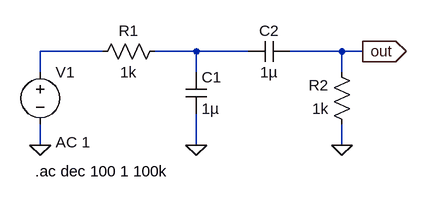
[diagram p0: schematic Frequency_Response_BandPass.asc]
Frequency_Response_BandPass.asc, the LTspice schematic file:
Version 4
SHEET 1 880 680
WIRE 128 112 32 112
WIRE 272 112 208 112
WIRE 352 112 272 112
WIRE 496 112 416 112
WIRE 528 112 496 112
WIRE 32 144 32 112
WIRE 272 144 272 112
WIRE 496 144 496 112
WIRE 32 256 32 224
WIRE 272 256 272 208
WIRE 496 256 496 224
FLAG 272 256 0
FLAG 32 256 0
FLAG 496 256 0
FLAG 528 112 out
IOPIN 528 112 Out
SYMBOL voltage 32 128 R0
WINDOW 123 24 124 Left 2
WINDOW 39 0 0 Left 0
SYMATTR InstName V1
SYMATTR Value ""
SYMATTR Value2 AC 1
SYMBOL res 224 96 R90
WINDOW 0 0 56 VBottom 2
WINDOW 3 32 56 VTop 2
SYMATTR InstName R1
SYMATTR Value 1k
SYMBOL res 512 240 R180
WINDOW 0 36 76 Left 2
WINDOW 3 36 40 Left 2
SYMATTR InstName R2
SYMATTR Value 1k
SYMBOL cap 256 144 R0
SYMATTR InstName C1
SYMATTR Value 1µ
SYMBOL cap 416 96 R90
WINDOW 0 0 32 VBottom 2
WINDOW 3 32 32 VTop 2
SYMATTR InstName C2
SYMATTR Value 1µ
TEXT 24 296 Left 2 !.ac dec 100 1 100k

The netlist it stands for:
* Frequency_Response_BandPass.asc
V1 N001 0 AC 1
R1 N002 N001 1k
R2 0 out 1k
C1 N002 0 1µ
C2 out N002 1µ
.ac dec 100 1 100k
.backanno
.end